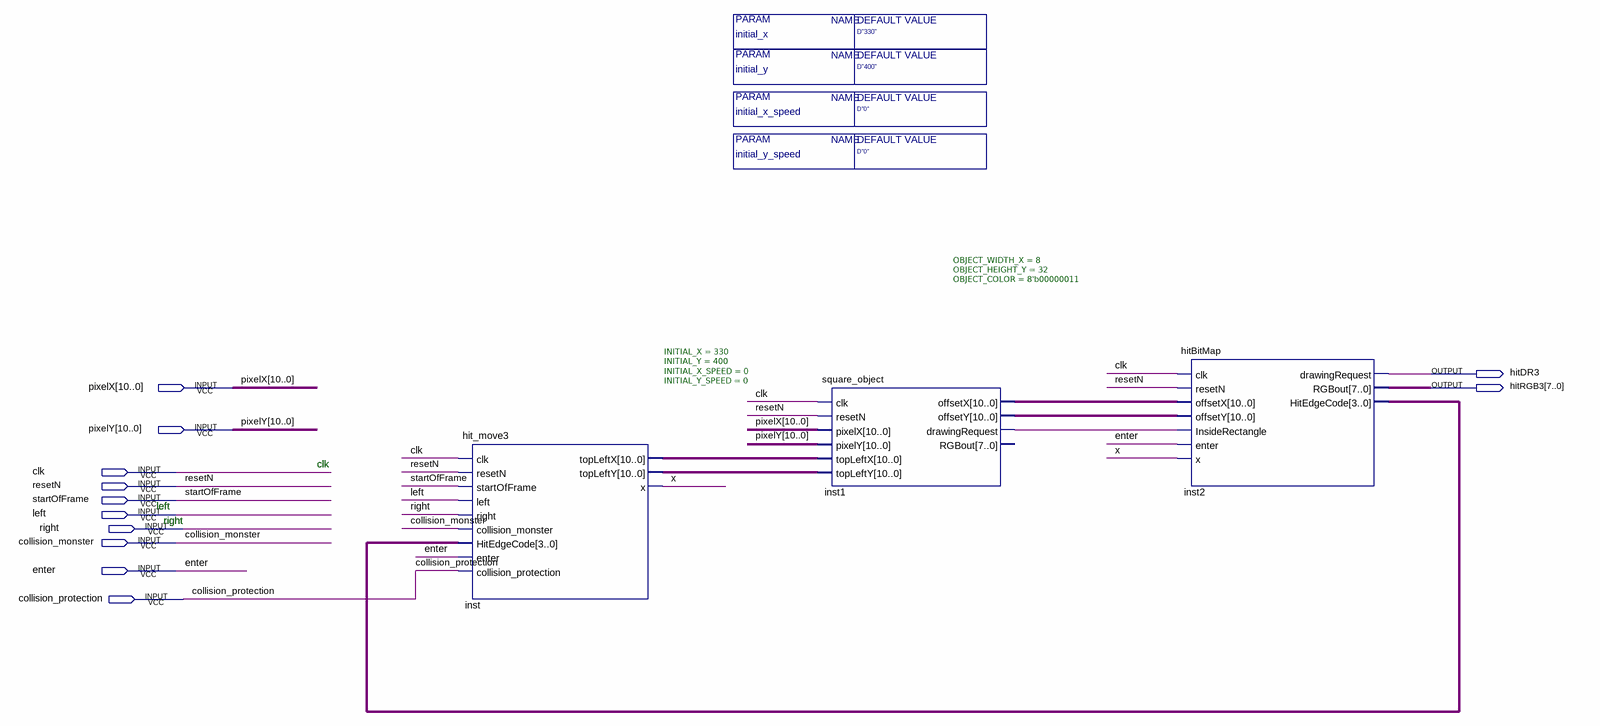
[diagram p0: schematic sheet]
// Quartus schematic Hit_Block3.bdf as structural Verilog: 3 symbols, 12 pins
module Hit_Block3 #(parameter initial_y = "D\"400\"", parameter initial_x_speed = "D\"0\"", parameter initial_y_speed = "D\"0\"", parameter initial_x = "D\"330\"") (
  input  [10:0] pixelX,
  input  [10:0] pixelY,
  input  clk,
  input  resetN,
  input  startOfFrame,
  input  left,
  input  right,
  input  collision_monster,
  input  enter,
  input  collision_protection,
  output hitDR3,
  output [7:0] hitRGB3
);

  wire inst1_drawingrequest, x;
  wire [3:0] inst2_hitedgecode;
  wire [10:0] inst1_offsetx, inst1_offsety, inst_topleftx, inst_toplefty;

  hit_move3 #(.INITIAL_X(330), .INITIAL_Y(400), .INITIAL_X_SPEED(0), .INITIAL_Y_SPEED(0)) inst (
    .clk(clk), .resetN(resetN), .startOfFrame(startOfFrame), .left(left), .right(right),
    .collision_monster(collision_monster), .HitEdgeCode(inst2_hitedgecode), .enter(enter),
    .collision_protection(collision_protection), .topLeftX(inst_topleftx), .topLeftY(inst_toplefty), .x(x));
  square_object #(.OBJECT_WIDTH_X(8), .OBJECT_HEIGHT_Y(32), .OBJECT_COLOR(8'b00000011)) inst1 (
    .clk(clk), .resetN(resetN), .pixelX(pixelX), .pixelY(pixelY), .topLeftX(inst_topleftx),
    .topLeftY(inst_toplefty), .offsetX(inst1_offsetx), .offsetY(inst1_offsety),
    .drawingRequest(inst1_drawingrequest));  // open: RGBout
  hitBitMap inst2 (
    .clk(clk), .resetN(resetN), .offsetX(inst1_offsetx), .offsetY(inst1_offsety),
    .InsideRectangle(inst1_drawingrequest), .enter(enter), .x(x), .drawingRequest(hitDR3), .RGBout(hitRGB3),
    .HitEdgeCode(inst2_hitedgecode));

  // Notes on the sheet:
  //   clk
  //   left
  //   right
endmodule
